# Altium project Atlium_BobPeaseGlitcher.PrjPcb
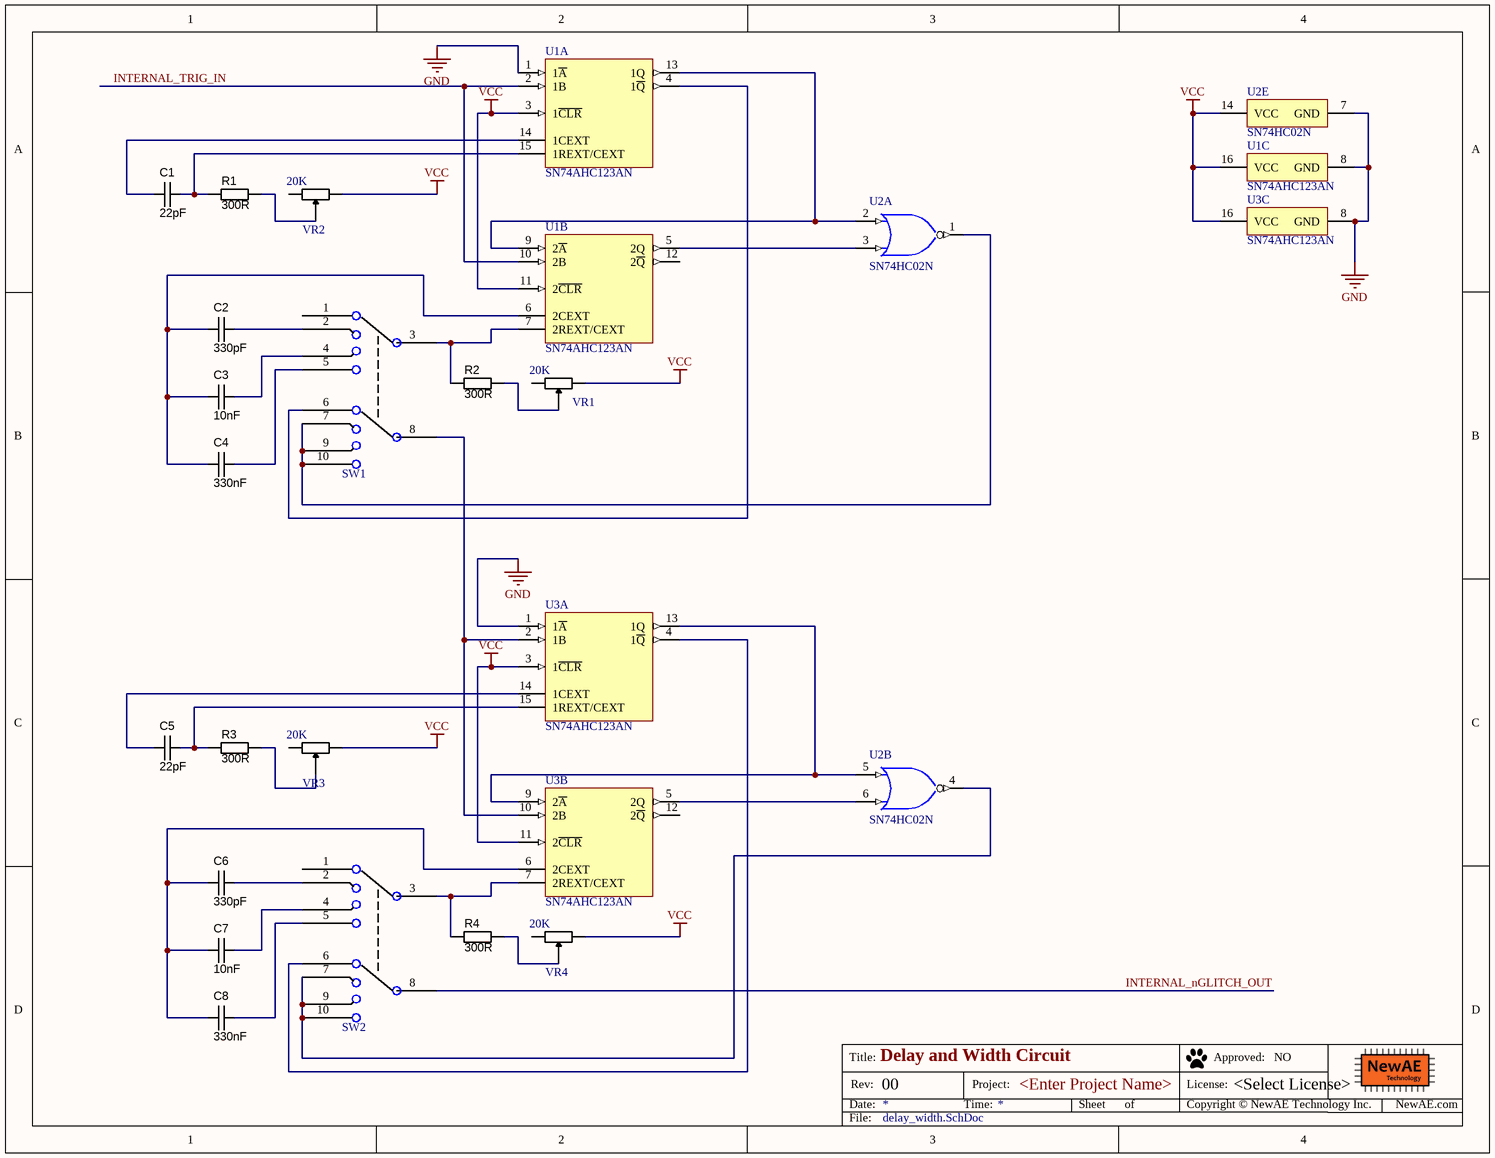
[diagram p0: delay_width.SchDoc]
PrjLicense: <Select License>; PrjName: <Enter Project Name>; PrjRev: 00
4 sheets, 71 parts. Net scope: global (net labels, ports and power ports of the same name join across sheets).
Board file: solder_glitcher.PcbDoc
Sheets:
  delay_width.SchDoc
  output_driver.SchDoc
  power.SchDoc
  inputs.SchDoc

## Sheet delay_width.SchDoc: Delay and Width Circuit
size Letter; Organization: NewAE Technology Inc.; Address1: 1083 Queen St., Suite 196; Address2: Halifax; Address3: NS; Address4: Canada B3H 0B2; SheetApproved: NO

### Parts
C1  value 22pF  [CAPC500P450250X550]  (hidden comment: approved sub OK)
C2  value 330pF  [CAPC500P450250X550]  (hidden comment: approved sub OK)
C3  value 10nF  [CAPC500P450250X550]  (hidden comment: approved sub OK)
C4  value 330nF  [CAPC500P450250X550]  (hidden comment: approved sub OK)
C5  value 22pF  [CAPC500P450250X550]  (hidden comment: approved sub OK)
C6  value 330pF  [CAPC500P450250X550]  (hidden comment: approved sub OK)
C7  value 10nF  [CAPC500P450250X550]  (hidden comment: approved sub OK)
C8  value 330nF  [CAPC500P450250X550]  (hidden comment: approved sub OK)
R1  value 300R  [RESTH_AXIAL-0.4]  (hidden comment: Carbon Film)
R2  value 300R  [RESTH_AXIAL-0.4]  (hidden comment: Carbon Film)
R3  value 300R  [RESTH_AXIAL-0.4]  (hidden comment: Carbon Film)
R4  value 300R  [RESTH_AXIAL-0.4]  (hidden comment: Carbon Film)
SW1  SS-24E06-TG 5 (P)  [CK_SS24E06TG5P]  (value not drawn)
SW2  SS-24E06-TG 5 (P)  [CK_SS24E06TG5P]  (value not drawn)
U1  SN74AHC123AN  [N0016A]  (parts A,B,C of 3)
U2  SN74HC02N  [N0014A]  (parts A,B,E of 5)
U3  SN74AHC123AN  [N0016A]  (parts A,B,C of 3)
VR1  20K  [RES_PDB18]
VR2  20K  [RES_PDB18]
VR3  20K  [RES_PDB18]
VR4  20K  [RES_PDB18]

### Nets
GND: U1.1(1~{A}) U1.8(GND) U2.7(GND) U3.1(1~{A}) U3.8(GND)
VCC: U1.3(1~{CLR}) U1.11(2~{CLR}) U1.16(VCC) U2.14(VCC) U3.3(1~{CLR}) U3.11(2~{CLR}) U3.16(VCC) VR1.1 VR2.1 VR3.1 VR4.1
INTERNAL_nGLITCH_OUT: SW2.8
INTERNAL_TRIG_IN: U1.2(1B) U1.10(2B)
NetC1_1: C1.1 U1.14(1CEXT)
NetC1_2: C1.2 R1.1 U1.15(1REXT/CEXT)
NetC2_1: C2.1 C3.1 C4.1 U1.6(2CEXT)
NetC2_2: C2.2 SW1.2
NetC3_2: C3.2 SW1.4
NetC4_2: C4.2 SW1.5
NetC5_1: C5.1 U3.14(1CEXT)
NetC5_2: C5.2 R3.1 U3.15(1REXT/CEXT)
NetC6_1: C6.1 C7.1 C8.1 U3.6(2CEXT)
NetC6_2: C6.2 SW2.2
NetC7_2: C7.2 SW2.4
NetC8_2: C8.2 SW2.5
NetR1_2: R1.2 VR2.2
NetR2_1: R2.1 SW1.3 U1.7(2REXT/CEXT)
NetR2_2: R2.2 VR1.2
NetR3_2: R3.2 VR3.2
NetR4_1: R4.1 SW2.3 U3.7(2REXT/CEXT)
NetR4_2: R4.2 VR4.2
NetSW1_6: SW1.6 U1.4(1~{Q})
NetSW1_7: SW1.7 SW1.9 SW1.10 U2.1(1Y)
NetSW1_8: SW1.8 U3.2(1B) U3.10(2B)
NetSW2_6: SW2.6 U3.4(1~{Q})
NetSW2_7: SW2.7 SW2.9 SW2.10 U2.4(2Y)
NetU1_5: U1.5(2Q) U2.3(1B)
NetU1_9: U1.9(2~{A}) U1.13(1Q) U2.2(1A)
NetU2_5: U2.5(2A) U3.9(2~{A}) U3.13(1Q)
NetU2_6: U2.6(2B) U3.5(2Q)

Not connected (* = marked no-connect by the designer): SW1 1; SW2 1; U1 12(2~{Q}); U3 12(2~{Q}); VR1 3; VR2 3; VR3 3; VR4 3

### Notes on the sheet
- Title:
- Date:
- Rev:
- Time:
- Project:
- Sheet
- of
- License:
- Copyright © NewAE Technology Inc.
- Approved:
- NewAE.com
- File:

### Library data of the parts
C1-C8 = CAPR_220n_Radial_5mm: Capacitor Ceramic 220nF 10% 50V X7R radial 5mm lead spacing; Manufacturer 1: TDK Corporation; Ratings: 50V; X7R; SCDType: spec; Tolerance: ±10%; Material: ceramic; Supplier 1: Digi-Key; Package / Case: 0.217" L x 0.177" W (5.50mm x 4.50mm) radial 5mm LS; Operating Temperature: -55°C ~ 125°C; ComponentLink1URL: http://www.tdk.co.jp/tefe02/e4941_fk.pdf; ComponentLink1Description: e4941_fk datasheet
R1-R4 = RES_220R_Axial_0.25W_5%: Resistor THD Axial 220 Ohm 0.25W 5% Carbon Film; Manufacturer 1: Yageo; Manufacturer Part Number 1: CFR-25JB-220R; Ratings: 1/4W; SCDType: spec; Tolerance: ±5%; Package / Case: Axial; Supplier 1: Digi-Key; Supplier Part Number 1: 220QBK-ND
SW1 SW2 = SS24E06TG5P: 2P4T Slide, C&K Through Hole; Manufacture 1: C&K Components; Component Group: Switch; PP Material Stack: 0; Part Number: SS24E06TG5P; Manufacture Part Number 1: SS-24E06-TG 5 (P); Pin Count: 10; Supplier 1: Digi-Key; Supplier Part Number 1: CKN10394-ND; Component Kind: Standard; Component Type: Standard; PP Rotation: 0
U1 U3 = CMP-1629-00116-2: Dual Retriggerable Monostable Multivibrators, N0016A, TUBE; Manufacturer: Texas Instruments; F @ Nom Voltage(Max)(Mhz): 110; Input Type: LVTTL/CMOS; Output Type: CMOS; VCC(Max)(V): 5.5; VCC(Min)(V): 2; Voltage(Nom)(V): 3.3,5; Rating: Catalog; tpd @ Nom Voltage(Max)(ns): 29.5,17; Technology Family: AHC; Schmitt Trigger: No; ICC @ Nom Voltage(Max)(mA): 0.04; Output Drive (IOL/IOH)(Max)(mA): 50/-50; PackageReference: N0016A; Bits(#): 2; Operating Temperature Range(C): -40 to 85; Generic Part Number: SN74AHC123A; Code_JEDEC: MS-001; DatasheetVersion: SCLS352H
U2 = CMP-0806-00198-3: Quadruple 2-Input Positive-NOR Gates, N0014A, TUBE; Manufacturer: Texas Instruments; F @ Nom Voltage(Max)(Mhz): 70; Rating: Catalog; Input Type: CMOS; Voltage(Nom)(V): 5; VCC(Min)(V): 2; Output Drive (IOL/IOH)(Max)(mA): 4/-4; ICC @ Nom Voltage(Max)(mA): 0.02; VCC(Max)(V): 6; Bits(#): 4; tpd @ Nom Voltage(Max)(ns): 23; Operating Temperature Range(C): -40 to 85; PackageVersion: http://www.ti.com/lit/ml/mpdi002c/mpdi002c.pdf; Generic Part Number: SN74HC02; Output Type: CMOS; Code_JEDEC: MS-001; DatasheetVersion: SCLS076E; PackageReference: N0014A
VR1-VR4 = POT_PDB181: POT 1/5W CARBON LINEAR VAR RESISTOR; Manufacture 1: Bourns; Manufacture Part Number 1: PDB181-K420K-203B; PP Material Stack: 0; Part Number: POT_PDB181; Component Group: Resistor; Pin Count: 3; Component Kind: Standard; Component Type: Standard; PP Rotation: 0

## Sheet output_driver.SchDoc: Output Drivers
size Letter; Organization: NewAE Technology Inc.; Address1: 1083 Queen St., Suite 196; Address2: Halifax; Address3: NS; Address4: Canada B3H 0B2; SheetApproved: NO
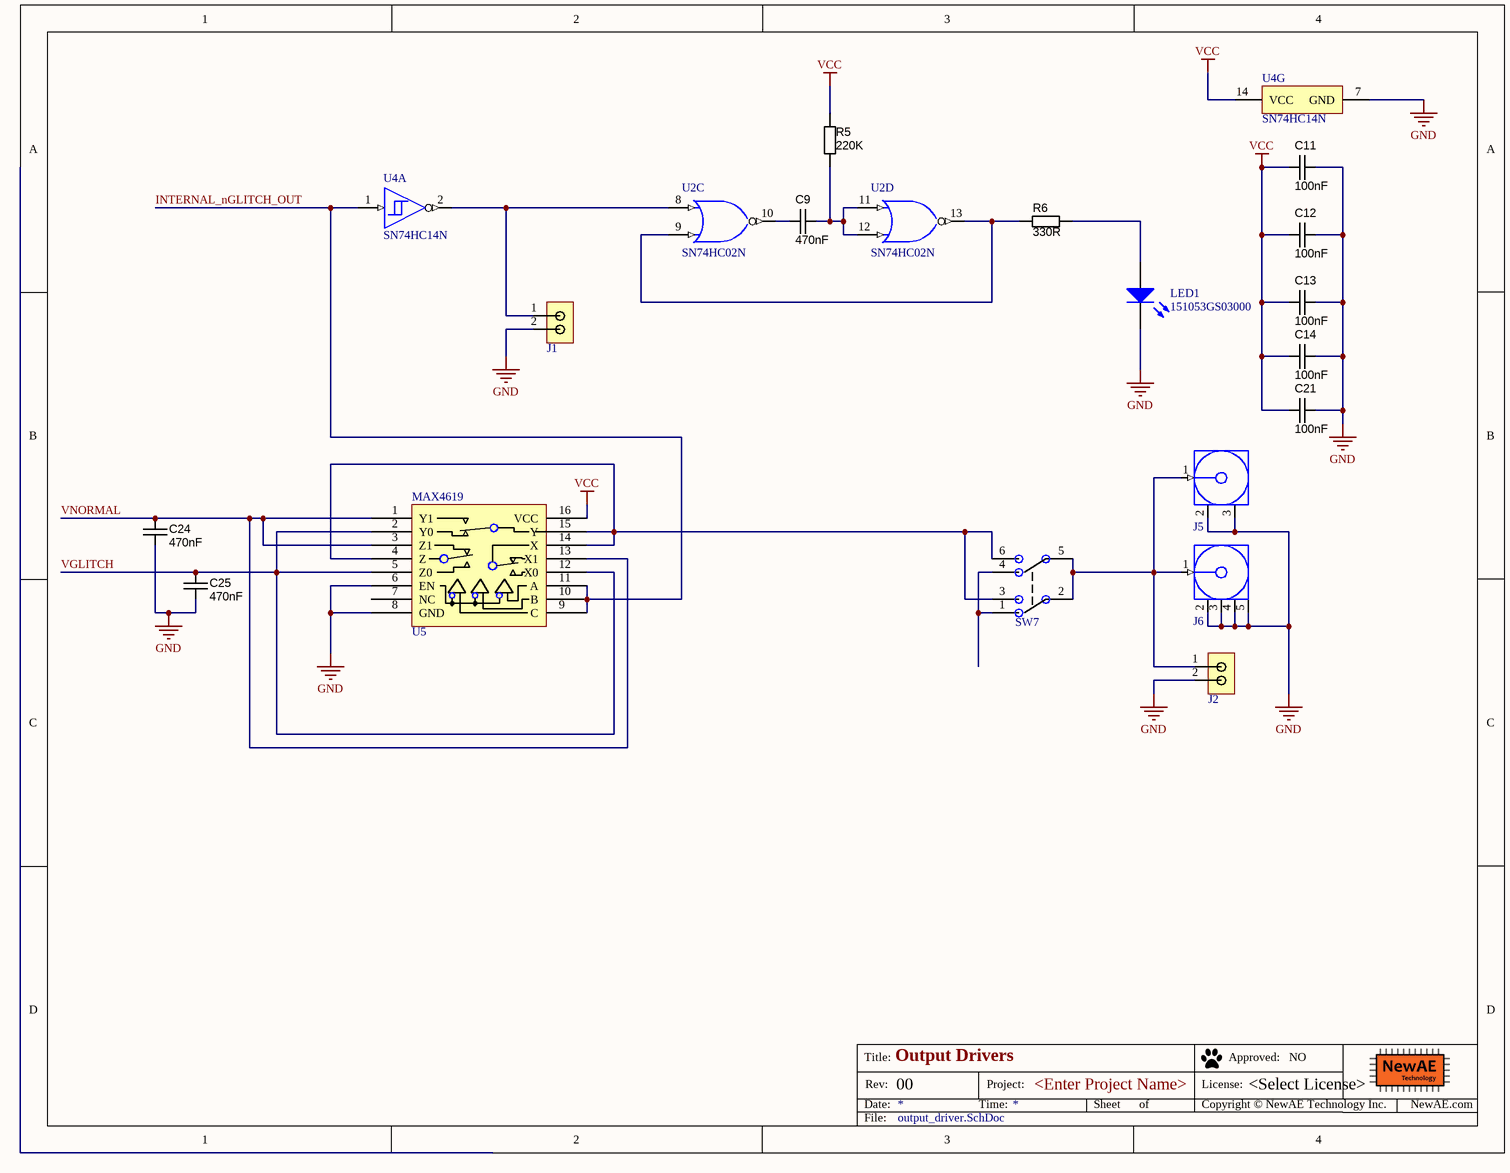
[diagram p1: output_driver.SchDoc]

### Parts
C9  value 470nF  [CAPC500P450250X550]  (hidden comment: approved sub OK)
C11  value 100nF  [CAPC500P450250X550]  (hidden comment: approved sub OK)
C12  value 100nF  [CAPC500P450250X550]  (hidden comment: approved sub OK)
C13  value 100nF  [CAPC500P450250X550]  (hidden comment: approved sub OK)
C14  value 100nF  [CAPC500P450250X550]  (hidden comment: approved sub OK)
C21  value 100nF  [CAPC500P450250X550]  (hidden comment: approved sub OK)
C24  value 470nF  [CAPC500P450250X550]  (hidden comment: approved sub OK)
C25  value 470nF  [CAPC500P450250X550]  (hidden comment: approved sub OK)
J1  Jumper  [2x2.54mm_Header]  (value not drawn)
J2  Jumper  [2x2.54mm_Header]  (value not drawn)
J5  73171-3150  [73171-3150]  (value not drawn)
J6  CON-SMA-PCBEDGE-003.062  [CON-SMAM-PCB-EDGE062]  (value not drawn)
LED1  151053GS03000  [Type 5mm]
R5  value 220K  [RESTH_AXIAL-0.4]  (hidden comment: Carbon Film)
R6  value 330R  [RESTH_AXIAL-0.4]  (hidden comment: Carbon Film)
SW7  EG2207  [EG2207]  (value not drawn)
U2  SN74HC02N  [N0014A]  (parts C,D of 5)
U4  SN74HC14N  [N0014A]  (parts A,G of 7)
U5  MAX4619  [DIP16]

### Nets
GND: C11.1 C12.1 C13.1 C14.1 C21.1 C24.1 C25.1 J1.2 J2.2 J5.2(GND) J5.3(GND) J6.2(GND) J6.3(GND) J6.4(GND) J6.5(GND) LED1.1(K) U4.7(GND) U5.6(EN) U5.8(GND)
VCC: C11.2 C12.2 C13.2 C14.2 C21.2 R5.2 U4.14(VCC) U5.16(VCC)
INTERNAL_nGLITCH_OUT: U4.1(1A) U5.9(C) U5.10(B) U5.11(A)
VGLITCH: C25.2 U5.2(Y0) U5.5(Z0) U5.12(X0)
VNORMAL: C24.2 U5.1(Y1) U5.3(Z1) U5.13(X1)
NetC9_1: C9.1 U2.10(3Y)
NetC9_2: C9.2 R5.1 U2.11(4A) U2.12(4B)
NetJ1_1: J1.1 U2.8(3A) U4.2(~{1Y})
NetJ2_1: J2.1 J5.1(Signal) J6.1(Signal) SW7.2(IN) SW7.5(IN)
NetLED1_2: LED1.2(A) R6.1
NetR6_2: R6.2 U2.9(3B) U2.13(4Y)
NetSW7_1: SW7.1(IN) SW7.4(IN)
NetSW7_3: SW7.3(IN) SW7.6(IN) U5.4(Z) U5.14(X) U5.15(Y)

Not connected (* = marked no-connect by the designer): U5 7(NC)

### Notes on the sheet
- Title:
- Date:
- Rev:
- Time:
- Project:
- Sheet
- of
- License:
- Copyright © NewAE Technology Inc.
- Approved:
- NewAE.com
- File:

### Library data of the parts
C9 C24 C25 = CAPR_220n_Radial_5mm: Capacitor Ceramic 100nF 10% 50V X7R radial 5mm lead spacing; Manufacturer 1: TDK Corporation; Ratings: 50V; X7R; SCDType: spec; Tolerance: ±10%; Material: ceramic; Supplier 1: Digi-Key; Package / Case: 0.217" L x 0.177" W (5.50mm x 4.50mm) radial 5mm LS; Operating Temperature: -55°C ~ 125°C; ComponentLink1URL: http://www.tdk.co.jp/tefe02/e4941_fk.pdf; ComponentLink1Description: e4941_fk datasheet
C11-C14 C21 = CAPR_220n_Radial_5mm: as C1 on sheet delay_width; Tolerance: ±10%; Material: ceramic; Supplier 1: Digi-Key; Package / Case: 0.217" L x 0.177" W (5.50mm x 4.50mm) radial 5mm LS; Operating Temperature: -55°C ~ 125°C; ComponentLink1URL: http://www.tdk.co.jp/tefe02/e4941_fk.pdf; ComponentLink1Description: e4941_fk datasheet
J1 J2 = 2_PIN_JUMPER: 1x2 2.54mm header, male pins; Manufacture 1: Harwin; Manufacture Part Number 1: M20-9990246; Component Group: PCB Feature; PP Material Stack: 0; Part Number: 2_PIN_JUMPER; Pin Count: 2; Supplier 1: Digi-Key; Supplier Part Number 1: 952-2262-ND; Mounting Technology: Through-hole; RoHS: Yes; Component Kind: Standard; Component Type: Standard; PP Rotation: 0
J5 = CON-BNC-CHEAP: Molex Cheap R/A BNC; Component Group: Connector; PP Material Stack: 0; Part Number: CON-BNC-CHEAP; Manufacture 1: Molex; Manufacture Part Number 1: 73171-3150; Pin Count: 3; Supplier 1: Digi-Key; Component Kind: Standard; Component Type: Standard; PP Rotation: 0
J6 = CON-SMA-PCBEDGE-003.062: SMA Female Edge Mount Connector for 0.062" Thick Board; Part Number: CON-SMA-PCBEDGE-003.062; Component Group: Connector; Pin Count: 5; ComponentLink1Description: Manufacturer URL; ComponentLink1URL: http://www.linxtechnologies.com/; ComponentLink2Description: Datasheet; ComponentLink2URL: http://www.connectorcity.com/diagrams/SMA/CONSMA003.062.pdf; Component Kind: Standard; Component Type: Standard
LED1 = CMP-1489-00005-1: THT LED round mono-color waterclear, WL-TMRW, Green; Manufacturer: Wuerth Elektronik; ComponentLink2URL: http://katalog.we-online.de/pbs/datasheet/7448042001.pdfhttp://katalog.we-online.de/pbs/datasheet/7448042001.pdfhttp://katalog.we-online.de/pbs/datasheet/7448042001.pdfhttp://katalog.we-online.de/pbs/datasheet/151053GS03000.pdf; ComponentLink2Description: Datasheet; ComponentLink1URL: http://www.we-online.com; PackageReference: Type 5mm; ComponentLink1Description: Manufacturer URL; PartNumber: 151053GS03000; Emitting color: Green
R5 R6 = RES_220R_Axial_0.25W_5%: Resistor THD Axial 10K Ohm 0.25W 5% Carbon Film; Manufacturer 1: Yageo; Manufacturer Part Number 1: CFR-25JB-220R; Ratings: 1/4W; SCDType: spec; Tolerance: ±5%; Package / Case: Axial; Supplier 1: Digi-Key; Supplier Part Number 1: 220QBK-ND
SW7 = EG2207: DPDT Switch with 2 MH; Manufacture 1: E-Switch; PP Material Stack: 0; Part Number: EG2207; Component Group: Switch; Manufacture Part Number 1: EG2207; Pin Count: 8; Supplier 1: Digi-Key; Supplier Part Number 1: EG1940-ND; Mounting Technology: Through-hole; RoHS: Yes; Component Kind: Standard; Component Type: Standard; PP Rotation: 0
U2 = CMP-0806-00198-3: as U2 on sheet delay_width; Operating Temperature Range(C): -40 to 85; PackageVersion: http://www.ti.com/lit/ml/mpdi002c/mpdi002c.pdf; Generic Part Number: SN74HC02; Output Type: CMOS; Code_JEDEC: MS-001; DatasheetVersion: SCLS076E; PackageReference: N0014A
U4 = CMP-1615-00889-3: Hex Schmitt-Trigger Inverters, N0014A, TUBE; Manufacturer: Texas Instruments; Input Type: CMOS; Voltage(Nom)(V): 5; VCC(Min)(V): 2; tpd @ Nom Voltage(Max)(ns): 31; Technology Family: HC; VCC(Max)(V): 6; F @ Nom Voltage(Max)(Mhz): 20; Output Drive (IOL/IOH)(Max)(mA): -4/4; Rating: Catalog; Schmitt Trigger: Yes; ICC @ Nom Voltage(Max)(mA): 0.02; PackageReference: N0014A; Code_JEDEC: MS-001; Operating Temperature Range(C): -40 to 85; Generic Part Number: SN74HC14; Bits(#): 6; DatasheetVersion: SCLS085G; Output Type: CMOS
U5 = MAX4619: Analog Mux; Manufacture 1: Maxim; Component Group: Analog IC; PP Material Stack: 0; Part Number: MAX4619; Manufacture Part Number 1: MAX4619; Pin Count: 16; Component Kind: Standard; Component Type: Standard; PP Rotation: 0

## Sheet power.SchDoc: Power
size Letter; Organization: NewAE Technology Inc.; Address1: 1083 Queen St., Suite 196; Address2: Halifax; Address3: NS; Address4: Canada B3H 0B2; SheetApproved: NO
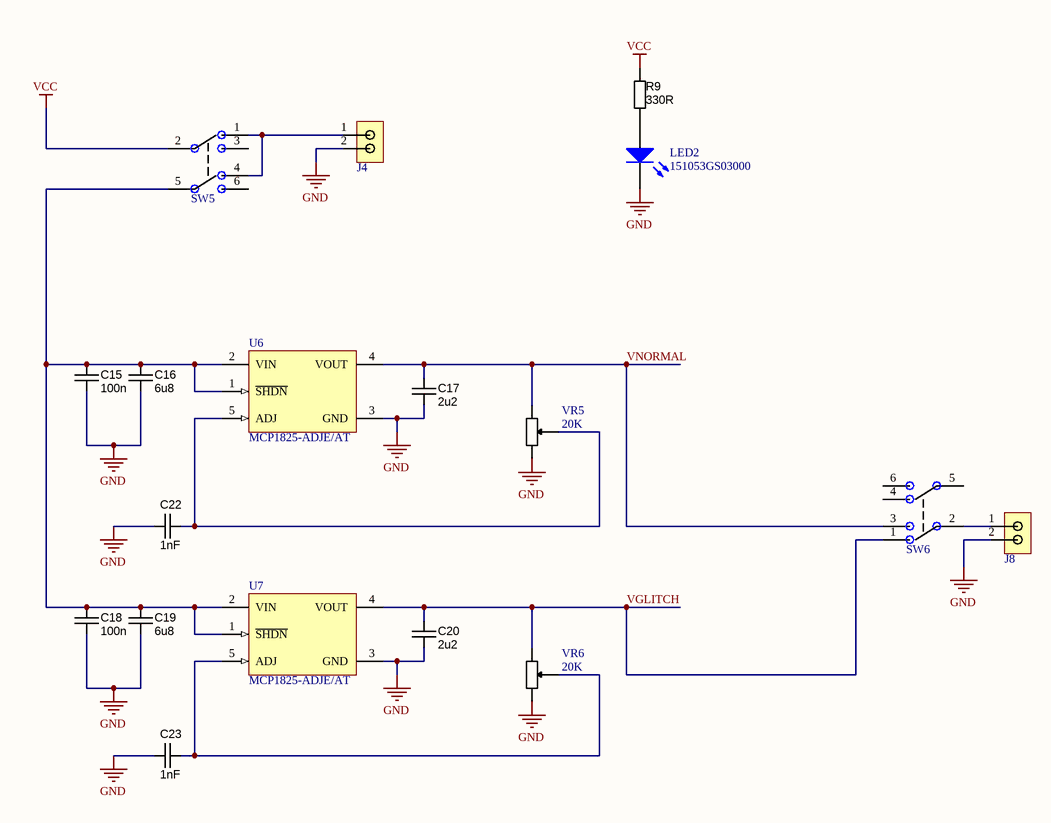
[diagram p2: power.SchDoc]

### Parts
C15  value 100n  [CAPC500P450250X550]  (hidden comment: approved sub OK)
C16  value 6u8  [CAPC500P450250X550]  (hidden comment: approved sub OK)
C17  value 2u2  [CAPC500P450250X550]  (hidden comment: approved sub OK)
C18  value 100n  [CAPC500P450250X550]  (hidden comment: approved sub OK)
C19  value 6u8  [CAPC500P450250X550]  (hidden comment: approved sub OK)
C20  value 2u2  [CAPC500P450250X550]  (hidden comment: approved sub OK)
C22  value 1nF  [CAPC500P450250X550]  (hidden comment: approved sub OK)
C23  value 1nF  [CAPC500P450250X550]  (hidden comment: approved sub OK)
J4  Jumper  [2x2.54mm_Header]  (value not drawn)
J8  Jumper  [2x2.54mm_Header]  (value not drawn)
LED2  151053GS03000  [Type 5mm]
R9  value 330R  [RESTH_AXIAL-0.4]  (hidden comment: Carbon Film)
SW5  EG2207  [EG2207]  (value not drawn)
SW6  EG2207  [EG2207]  (value not drawn)
U6  MCP1825-ADJE/AT  [TO-220-AT5]
U7  MCP1825-ADJE/AT  [TO-220-AT5]
VR5  20K  [RES_PDB18]
VR6  20K  [RES_PDB18]

### Nets
GND: C15.1 C16.1 C17.1 C18.1 C19.1 C20.1 C22.2 C23.2 J4.2 J8.2 LED2.1(K) U6.3(GND) U7.3(GND) VR5.3 VR6.3
VCC: R9.1 SW5.2(IN)
VGLITCH: C20.2 SW6.1(IN) U7.4(VOUT) VR6.1
VNORMAL: C17.2 SW6.3(IN) U6.4(VOUT) VR5.1
NetC15_2: C15.2 C16.2 C18.2 C19.2 SW5.5(IN) U6.1(~{SHDN}) U6.2(VIN) U7.1(~{SHDN}) U7.2(VIN)
NetC22_1: C22.1 U6.5(ADJ) VR5.2
NetC23_1: C23.1 U7.5(ADJ) VR6.2
NetJ4_1: J4.1 SW5.1(IN) SW5.4(IN)
NetJ8_1: J8.1 SW6.2(IN)
NetLED2_2: LED2.2(A) R9.2

Not connected (* = marked no-connect by the designer): SW5 3(IN) 6(IN); SW6 4(IN) 5(IN) 6(IN)

### Notes on the sheet
- Title:
- Date:
- Rev:
- Time:
- Project:
- Sheet
- of
- License:
- Copyright © NewAE Technology Inc.
- Approved:
- NewAE.com
- File:

### Library data of the parts
C15-C20 C22 C23 = CAPR_220n_Radial_5mm: as C1 on sheet delay_width; Tolerance: ±10%; Material: ceramic; Supplier 1: Digi-Key; Package / Case: 0.217" L x 0.177" W (5.50mm x 4.50mm) radial 5mm LS; Operating Temperature: -55°C ~ 125°C; ComponentLink1URL: http://www.tdk.co.jp/tefe02/e4941_fk.pdf; ComponentLink1Description: e4941_fk datasheet
J4 J8 = 2_PIN_JUMPER: as J1 on sheet output_driver; Part Number: 2_PIN_JUMPER; Pin Count: 2; Supplier 1: Digi-Key; Supplier Part Number 1: 952-2262-ND; Mounting Technology: Through-hole; RoHS: Yes; Component Kind: Standard; Component Type: Standard; PP Rotation: 0
LED2 = CMP-1489-00005-1: as LED1 on sheet output_driver; ComponentLink2URL: http://katalog.we-online.de/pbs/datasheet/7448042001.pdfhttp://katalog.we-online.de/pbs/datasheet/7448042001.pdfhttp://katalog.we-online.de/pbs/datasheet/7448042001.pdfhttp://katalog.we-online.de/pbs/datasheet/151053GS03000.pdf; ComponentLink2Description: Datasheet; ComponentLink1URL: http://www.we-online.com; PackageReference: Type 5mm; ComponentLink1Description: Manufacturer URL; PartNumber: 151053GS03000; Emitting color: Green
R9 = RES_220R_Axial_0.25W_5%: as R5 on sheet output_driver; Tolerance: ±5%; Package / Case: Axial; Supplier 1: Digi-Key; Supplier Part Number 1: 220QBK-ND
SW5 SW6 = EG2207: as SW7 on sheet output_driver; Part Number: EG2207; Component Group: Switch; Manufacture Part Number 1: EG2207; Pin Count: 8; Supplier 1: Digi-Key; Supplier Part Number 1: EG1940-ND; Mounting Technology: Through-hole; RoHS: Yes; Component Kind: Standard; Component Type: Standard; PP Rotation: 0
U6 U7 = CMP-0136-01019-1: 500 mA, Low Voltage, Low Quiescent Current LDO Regulator, 5-Pin TO-220, Extended Temperature; PackageReference: TO-220-AT5; PackageVersion: revBB, Aug-2009; DatasheetVersion: revB, Feb-2008; PackageDescription: 5-Lead Plastic Transistor Outline (AT) [TO-220]
VR5 VR6 = POT_PDB181: as VR1 on sheet delay_width; Part Number: POT_PDB181; Component Group: Resistor; Pin Count: 3; Component Kind: Standard; Component Type: Standard; PP Rotation: 0

## Sheet inputs.SchDoc: Input
size Letter; Organization: NewAE Technology Inc.; Address1: 1083 Queen St., Suite 196; Address2: Halifax; Address3: NS; Address4: Canada B3H 0B2; SheetApproved: NO
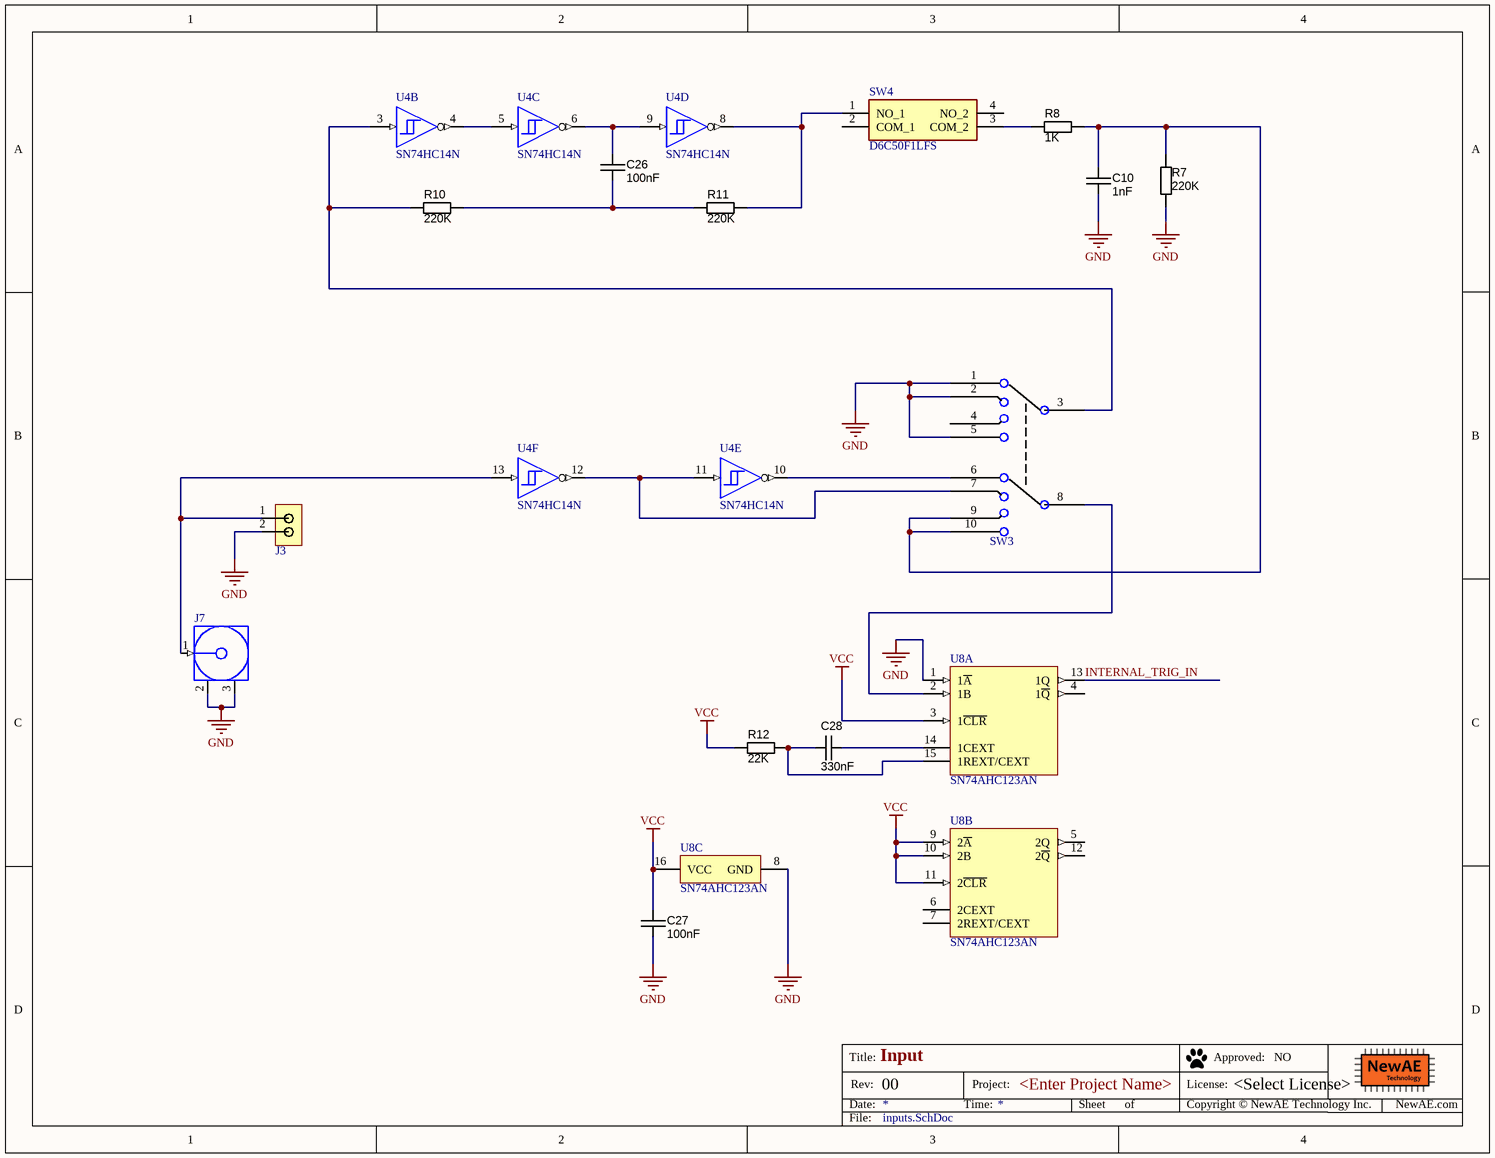
[diagram p3: inputs.SchDoc]

### Parts
C10  value 1nF  [CAPC500P450250X550]  (hidden comment: approved sub OK)
C26  value 100nF  [CAPC500P450250X550]  (hidden comment: approved sub OK)
C27  value 100nF  [CAPC500P450250X550]  (hidden comment: approved sub OK)
C28  value 330nF  [CAPC500P450250X550]  (hidden comment: approved sub OK)
J3  Jumper  [2x2.54mm_Header]  (value not drawn)
J7  73171-3150  [73171-3150]  (value not drawn)
R7  value 220K  [RESTH_AXIAL-0.4]  (hidden comment: Carbon Film)
R8  value 1K  [RESTH_AXIAL-0.4]  (hidden comment: Carbon Film)
R10  value 220K  [RESTH_AXIAL-0.4]  (hidden comment: Carbon Film)
R11  value 220K  [RESTH_AXIAL-0.4]  (hidden comment: Carbon Film)
R12  value 22K  [RESTH_AXIAL-0.4]  (hidden comment: Carbon Film)
SW3  SS-24E06-TG 5 (P)  [CK_SS24E06TG5P]  (value not drawn)
SW4  D6C50F1LFS  [D6C50F1LFS]
U4  SN74HC14N  [N0014A]  (parts B,C,D,E,F of 7)
U8  SN74AHC123AN  [N0016A]  (parts A,B,C of 3)

### Nets
GND: C10.1 C27.2 J3.2 J7.2(GND) J7.3(GND) R7.1 SW3.1 SW3.2 SW3.5 U8.1(1~{A}) U8.8(GND)
VCC: C27.1 R12.2 U8.3(1~{CLR}) U8.9(2~{A}) U8.10(2B) U8.11(2~{CLR}) U8.16(VCC)
INTERNAL_TRIG_IN: U8.13(1Q)
NetC10_2: C10.2 R7.2 R8.2 SW3.9 SW3.10
NetC26_1: C26.1 U4.6(~{3Y}) U4.9(4A)
NetC26_2: C26.2 R10.1 R11.2
NetC28_1: C28.1 R12.1 U8.15(1REXT/CEXT)
NetC28_2: C28.2 U8.14(1CEXT)
NetJ3_1: J3.1 J7.1(Signal) U4.13(6A)
NetR8_1: R8.1 SW4.3(COM_2)
NetR10_2: R10.2 SW3.3 U4.3(2A)
NetR11_1: R11.1 SW4.1(NO_1) U4.8(~{4Y})
NetSW3_6: SW3.6 U4.10(~{5Y})
NetSW3_7: SW3.7 U4.11(5A) U4.12(~{6Y})
NetSW3_8: SW3.8 U8.2(1B)
NetU4_4: U4.4(~{2Y}) U4.5(3A)

Not connected (* = marked no-connect by the designer): SW3 4; SW4 2(COM_1) 4(NO_2); U8 4(1~{Q}) 5(2Q) 6(2CEXT) 7(2REXT/CEXT) 12(2~{Q})

### Notes on the sheet
- Title:
- Date:
- Rev:
- Time:
- Project:
- Sheet
- of
- License:
- Copyright © NewAE Technology Inc.
- Approved:
- NewAE.com
- File:

### Library data of the parts
C10 C26-C28 = CAPR_220n_Radial_5mm: as C1 on sheet delay_width; Tolerance: ±10%; Material: ceramic; Supplier 1: Digi-Key; Package / Case: 0.217" L x 0.177" W (5.50mm x 4.50mm) radial 5mm LS; Operating Temperature: -55°C ~ 125°C; ComponentLink1URL: http://www.tdk.co.jp/tefe02/e4941_fk.pdf; ComponentLink1Description: e4941_fk datasheet
J3 = 2_PIN_JUMPER: as J1 on sheet output_driver; Part Number: 2_PIN_JUMPER; Pin Count: 2; Supplier 1: Digi-Key; Supplier Part Number 1: 952-2262-ND; Mounting Technology: Through-hole; RoHS: Yes; Component Kind: Standard; Component Type: Standard; PP Rotation: 0
J7 = CON-BNC-CHEAP: as J5 on sheet output_driver; Part Number: CON-BNC-CHEAP; Manufacture 1: Molex; Manufacture Part Number 1: 73171-3150; Pin Count: 3; Supplier 1: Digi-Key; Component Kind: Standard; Component Type: Standard; PP Rotation: 0
R7 R8 R10-R12 = RES_220R_Axial_0.25W_5%: as R1 on sheet delay_width; Tolerance: ±5%; Package / Case: Axial; Supplier 1: Digi-Key; Supplier Part Number 1: 220QBK-ND
SW3 = SS24E06TG5P: as SW1 on sheet delay_width; Part Number: SS24E06TG5P; Manufacture Part Number 1: SS-24E06-TG 5 (P); Pin Count: 10; Supplier 1: Digi-Key; Supplier Part Number 1: CKN10394-ND; Component Kind: Standard; Component Type: Standard; PP Rotation: 0
SW4 = D6C50F1LFS: Switch; Manufacturer_Name: C & K COMPONENTS; Datasheet Link: https://componentsearchengine.com/Datasheets/1/D6C50F1LFS.pdf; Height: 9.8mm; Manufacturer_Part_Number: D6C50F1LFS; Mouser Part Number: 611-D6C50F1LFS; Mouser Price/Stock: https://www.mouser.com/Search/Refine.aspx?Keyword=611-D6C50F1LFS
U4 = CMP-1615-00889-3: as U4 on sheet output_driver; PackageReference: N0014A; Code_JEDEC: MS-001; Operating Temperature Range(C): -40 to 85; Generic Part Number: SN74HC14; Bits(#): 6; DatasheetVersion: SCLS085G; Output Type: CMOS
U8 = CMP-1629-00116-2: as U1 on sheet delay_width; PackageReference: N0016A; Bits(#): 2; Operating Temperature Range(C): -40 to 85; Generic Part Number: SN74AHC123A; Code_JEDEC: MS-001; DatasheetVersion: SCLS352H

## Nets that join several sheets
GND: delay_width (5 pins), output_driver (19 pins), power (15 pins), inputs (11 pins)
VCC: delay_width (11 pins), output_driver (8 pins), power (R9.1 SW5.2), inputs (7 pins)
INTERNAL_nGLITCH_OUT: delay_width (SW2.8), output_driver (U4.1 U5.9 U5.10 U5.11)
INTERNAL_TRIG_IN: delay_width (U1.2 U1.10), inputs (U8.13)
VGLITCH: output_driver (C25.2 U5.2 U5.5 U5.12), power (C20.2 SW6.1 U7.4 VR6.1)
VNORMAL: output_driver (C24.2 U5.1 U5.3 U5.13), power (C17.2 SW6.3 U6.4 VR5.1)